# Altium project ECE315.PrjPcb
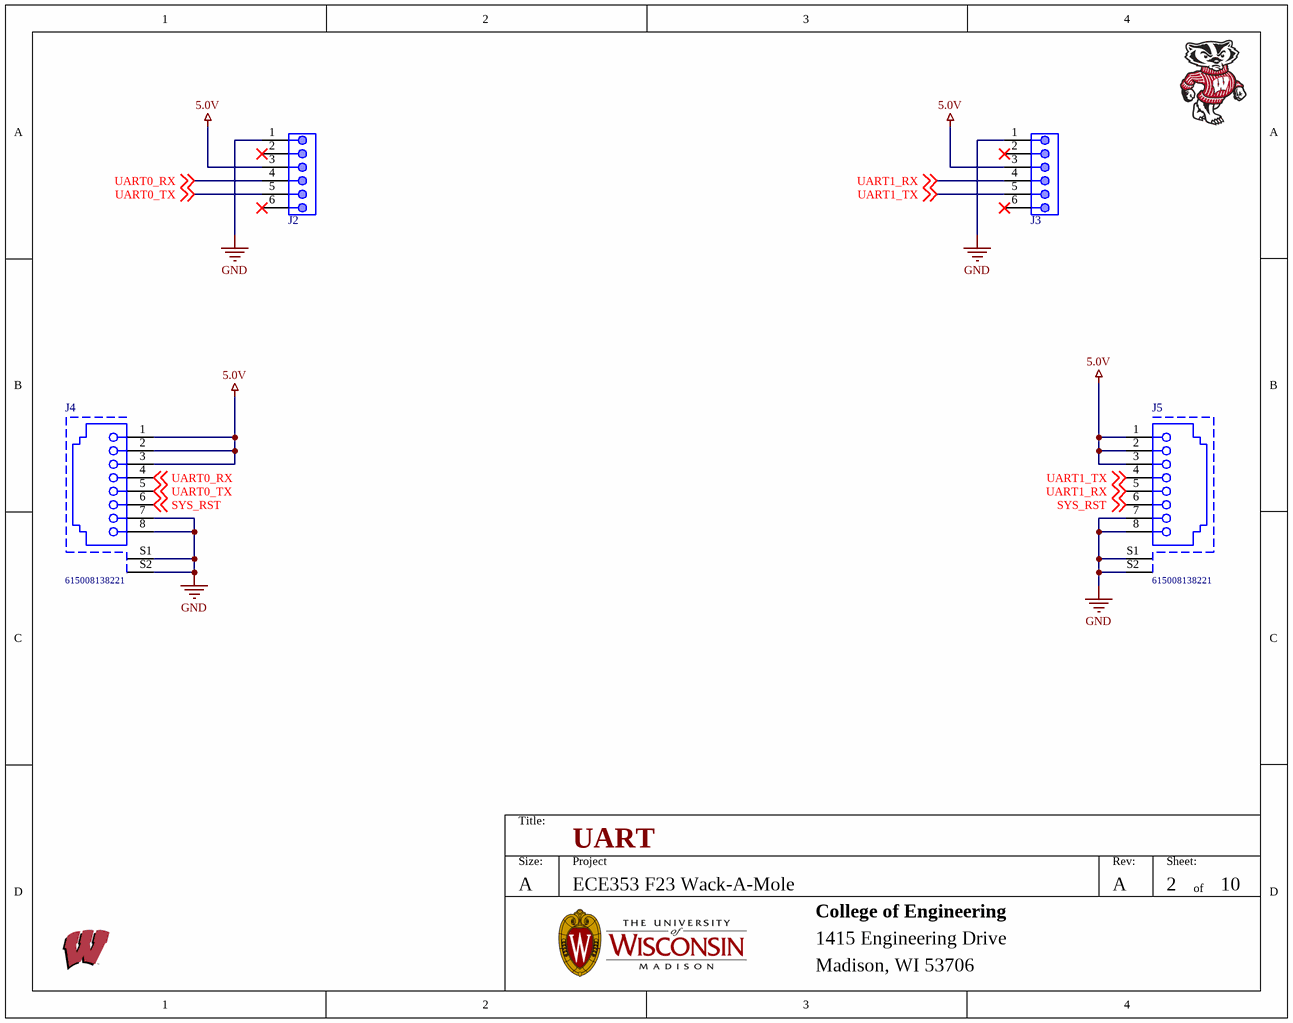
[diagram p0: 02-UART.SchDoc]
8 sheets, 62 parts. Net scope: global (net labels, ports and power ports of the same name join across sheets).
Board file: ECE315.PcbDoc
Sheets:
  02-UART.SchDoc
  03-LED-GREEN.SchDoc
  04-LED-YELLOW.SchDoc
  05-LED-RED.SchDoc
  06_MCU.SchDoc
  08-Power.SchDoc
  09_Buzzer.SchDoc
  10-Programmer.SchDoc

## Sheet 02-UART.SchDoc: UART
size A; Revision: A; SheetNumber: 2; SheetTotal: 10; ApprovedDate: 04/02/2019; AssemblyNumber: ECE315-F19; ECE315_Project_Name: ECE353 F23 Wack-A-Mole

### Parts
J2  (no value)  [HDR1X6]
J3  (no value)  [HDR1X6]
J4  615008138221  [615008138221]
J5  615008138221  [615008138221]

### Nets
5.0V: J2.3 J3.3 J4.1 J4.2 J4.3 J5.1 J5.2 J5.3
GND: J2.1 J3.1 J4.7 J4.8 J4.S1 J4.S2 J5.7 J5.8 J5.S1 J5.S2
SYS_RST: J4.6 J5.6 ; off-sheet SYS_RST
UART0_RX: J2.4 J4.4 ; off-sheet UART0_RX
UART0_TX: J2.5 J4.5 ; off-sheet UART0_TX
UART1_RX: J3.4 J5.5 ; off-sheet UART1_RX
UART1_TX: J3.5 J5.4 ; off-sheet UART1_TX

Not connected (* = marked no-connect by the designer): J2 2* 6*; J3 2* 6*

### Notes on the sheet
- Title:
- Size:
- A
- Project
- Rev:
- Sheet:
- of
- College of Engineering
- 1415 Engineering Drive
- Madison, WI 53706

### Library data of the parts
J2 J3 = CONN_HEADER_MALE_1x6: Female, 6C, Rt Angle, .100"CC; 3.15mm Tail, No Mounting; PBT, Phos. Bronze, 105 C; Manufacturer 1: Sullins; Manufacturer Part Number 1: PPPC061LGBN-RC; Number of Positions: 6; Connector Type: Header; Pitch: 0.1inch; Voltage Rating: 250V; Supplier 1: Digi-Key; Supplier Part Number 1: S5481-ND; RoHS: Yes; Category: Connectors; Stock 1: 12284; Pricing 1: 1=0.66, 10=0.56, 80=0.50288, 440=0.41148, 1000=0.36576, 5000=0.3302 (USD); Mount: Through Hole; Color: Black; Contact Plating: Gold; Contact Material: Bronze; Housing Color: Black; Housing Material: Plastic; Package Quantity: 1000; Number of Rows: 1; Packaging: Bulk; Termination: Solder; Contact Type: Female Socket; Length: 15.7mm; Width: 8.5mm; Height: 2.4mm; Lead Free: Lead Free; RoHS Compliant: Yes; ComponentLink1URL: https://media.digikey.com/pdf/Data%20Sheets/Sullins%20PDFs/Female_Headers.100_DS.pdf?src-supplier=Digi-Key; ComponentLink1Description: https://media.digikey.com/pdf/Data%20Sheets/Sullins%20PDFs/Female_Headers.100_DS.pdf?src-supplier=Digi-Key; ComponentLink2URL: http://www.sullinscorp.com/catalogs/78_Page80-81_HEADER_.100_2.54mm_FEMALE.pdf?src-supplier=Future+Electronics; ComponentLink2Description: http://www.sullinscorp.com/catalogs/78_Page80-81_HEADER_.100_2.54mm_FEMALE.pdf?src-supplier=Future+Electronics; Contact Finish - Mating: GOLD; Insulation Color: Black; Insulation Material: Polyester; Contact Shape: Square; Min Operating Temperature: -40°C; Max Operating Temperature: 105°C; Fastening Type: Pull; Series: -; Flammability Rating: UL94 V-0
J4 J5 = CMP-1502-01731-1: Modular Jack WR-MJ, Front Post, Shielded, Vertical Entry, THT, 8P8C; Manufacturer: Wurth Elektronik; Rated Current: 1.5A; Withstanding Voltage: 1000VAC; Working Voltage: 120VAC; Port: 1x1; Compliance: Leadfree/RoHS; Contact Resistance: 20mOhm; Publisher: WurthElektronik; Packaging: Tray; Manufacturer URL: http://www.we-online.de; Operating Temperature: -40to85degC; Package Reference: 615008138221; Mounting Technology: THT; Part Number: 615008138221; Datasheet URL: https://katalog.we-online.com/em/datasheet/615008138221.pdf; Pin Number: 8P8C; Entrance: Vertical

## Sheet 03-LED-GREEN.SchDoc: Green LEDs
size A; Revision: A; SheetNumber: 3; SheetTotal: 10; ECE315_Project_Name: ECE315 F23 Wack-A-Mole
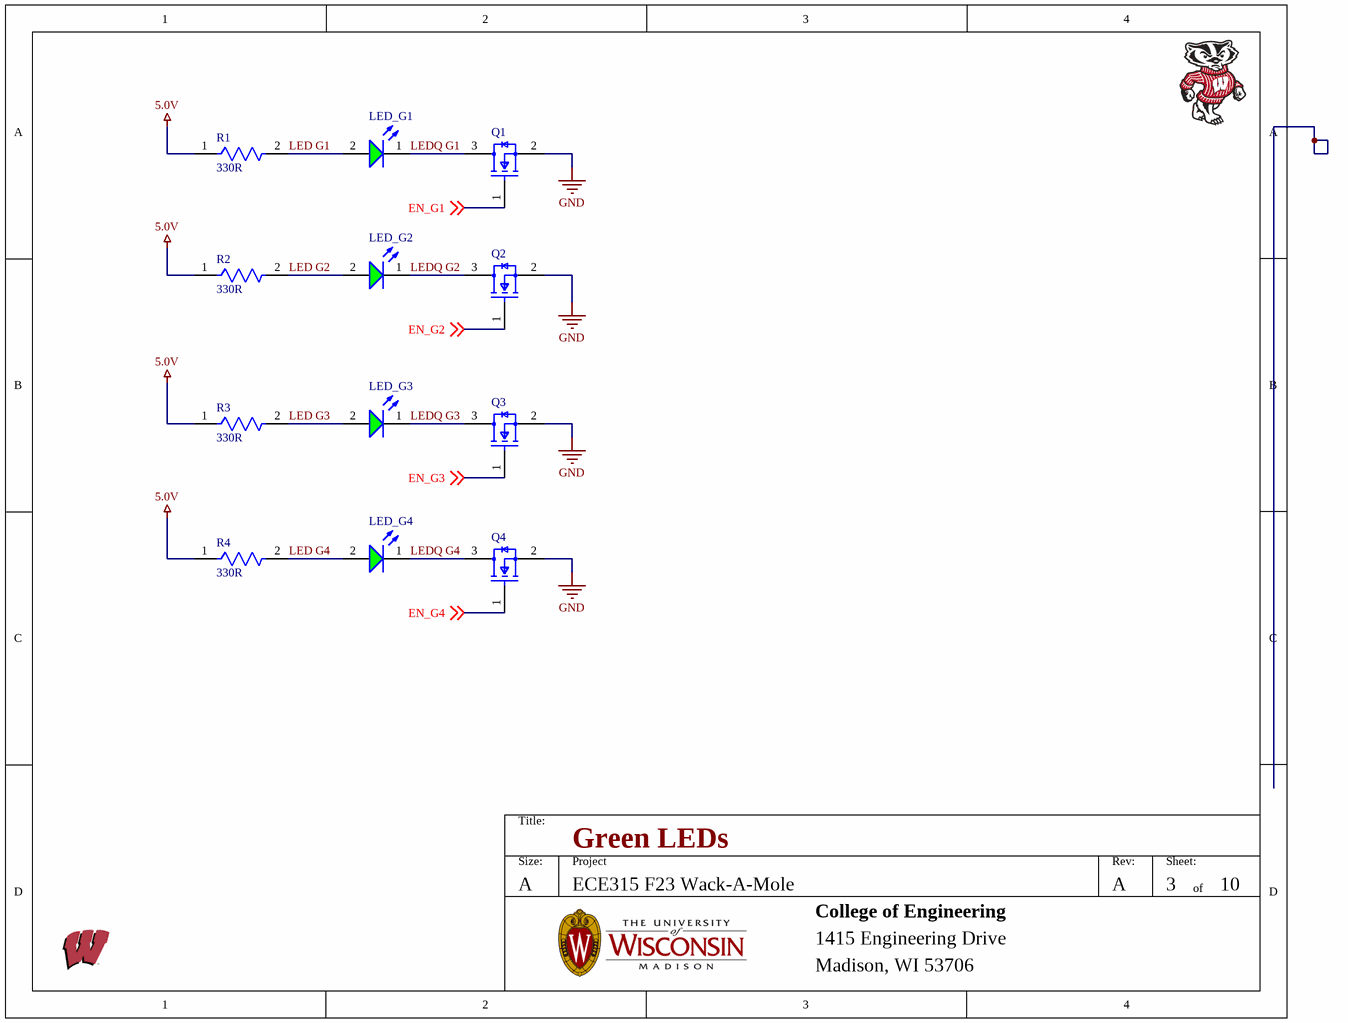
[diagram p1: 03-LED-GREEN.SchDoc]

### Parts
LED_G1  150120GS75000  [WL-SMCW_1206_150120xx75000]  (value not drawn)
LED_G2  150120GS75000  [WL-SMCW_1206_150120xx75000]  (value not drawn)
LED_G3  150120GS75000  [WL-SMCW_1206_150120xx75000]  (value not drawn)
LED_G4  150120GS75000  [WL-SMCW_1206_150120xx75000]  (value not drawn)
Q1  2N7002-7-F  [FP-SOT23-MFG]  (value not drawn)
Q2  2N7002-7-F  [FP-SOT23-MFG]  (value not drawn)
Q3  2N7002-7-F  [FP-SOT23-MFG]  (value not drawn)
Q4  2N7002-7-F  [FP-SOT23-MFG]  (value not drawn)
R1  Resistance: 330R  [FP-CRCW1206-e3-IPC_A]  (hidden comment: CRCW1206330RFKEA)
R2  Resistance: 330R  [FP-CRCW1206-e3-IPC_A]  (hidden comment: CRCW1206330RFKEA)
R3  Resistance: 330R  [FP-CRCW1206-e3-IPC_A]  (hidden comment: CRCW1206330RFKEA)
R4  Resistance: 330R  [FP-CRCW1206-e3-IPC_A]  (hidden comment: CRCW1206330RFKEA)

### Nets
5.0V: R1.1 R2.1 R3.1 R4.1
GND: Q1.2(S) Q2.2(S) Q3.2(S) Q4.2(S)
EN_G1: Q1.1(G) ; off-sheet EN_G1
EN_G2: Q2.1(G) ; off-sheet EN_G2
EN_G3: Q3.1(G) ; off-sheet EN_G3
EN_G4: Q4.1(G) ; off-sheet EN_G4
LED G1: LED_G1.2(A) R1.2
LED G2: LED_G2.2(A) R2.2
LED G3: LED_G3.2(A) R3.2
LED G4: LED_G4.2(A) R4.2
LEDQ G1: LED_G1.1(K) Q1.3(D)
LEDQ G2: LED_G2.1(K) Q2.3(D)
LEDQ G3: LED_G3.1(K) Q3.3(D)
LEDQ G4: LED_G4.1(K) Q4.3(D)

### Notes on the sheet
- Title:
- Size:
- A
- Project
- Rev:
- Sheet:
- of
- College of Engineering
- 1415 Engineering Drive
- Madison, WI 53706

### Library data of the parts
LED_G1-LED_G4 = CMP-1426-00014-3: NexarPartId: 29717787; Manufacturer: Wurth Electronics; Peak Wavelength: 515nm; Wavelength: 520nm; Test Current: 20mA; Dominant Wavelength: 525nm; Luminous Intensity: 450mcd; Max Junction Temperature (Tj): 95°C; Power Dissipation: 105mW; Reverse Voltage: 5V; Forward Current: 100mA; Viewing Angle: 140°; Forward Voltage: 3.2V; Lens Style: Clear, Rectangular; Lens Color: Colorless; Lens Transparency: Clear; Lens Size: 1.6mm; Width: 1.6mm; Case Code (Metric): 3216; Mount: Surface Mount; Min Operating Temperature: -40°C; Packaging: Tape and Reel; Length: 3.2mm; REACH SVHC: Unknown; Max Reverse Voltage (DC): 5V; Case/Package: 1206; Height: 680µm; Case Code (Imperial): 1206; Color: Green; RoHS: Compliant; Max Operating Temperature: 85°C; Supplier: Digi-Key; Supplier Part Number: 732-4990-1-ND; Manufacturer Part Number: 150120GS75000; Category: LEDs; Stock: 46051; Pricing: 1=0.23, 50=0.211, 100=0.182, 500=0.158 (USD); Mounting Technology: Surface Mount; Package Quantity: 1; Series: WL-SMCW; RoHS Compliant: Yes; Reach SVHC Compliant: Unknown; ComponentLink1URL: https://datasheet.ciiva.com/22656/150120gs75000-22656979.pdf?src-supplier=Element14; ComponentLink1Description: https://datasheet.ciiva.com/22656/150120gs75000-22656979.pdf?src-supplier=Element14; ComponentLink2URL: https://datasheet.ciiva.com/29279/759441-da-01-en-chipled-1206-w-kl-gruen-150120gs75000-29279042.pdf?src-supplier=Conrad; ComponentLink2Description: https://datasheet.ciiva.com/29279/759441-da-01-en-chipled-1206-w-kl-gruen-150120gs75000-29279042.pdf?src-supplier=Conrad; ComponentLink3URL: https://datasheet.ciiva.com/29561/150120gs75000-29561883.pdf?src-supplier=Digi-Key; ComponentLink3Description: https://datasheet.ciiva.com/29561/150120gs75000-29561883.pdf?src-supplier=Digi-Key; ComponentLink4URL: https://datasheet.ciiva.com/29561/150120gs75000-29561884.pdf?src-supplier=Digi-Key; ComponentLink4Description: https://datasheet.ciiva.com/29561/150120gs75000-29561884.pdf?src-supplier=Digi-Key; ComponentLink5URL: https://datasheet.ciiva.com/29561/150120gs75000-29561885.pdf?src-supplier=Digi-Key; ComponentLink5Description: https://datasheet.ciiva.com/29561/150120gs75000-29561885.pdf?src-supplier=Digi-Key; ComponentLink6URL: https://datasheet.ciiva.com/48430/150120gs75000-eng-tds-48430053.pdf?src-supplier=Distrelec; ComponentLink6Description: https://datasheet.ciiva.com/48430/150120gs75000-eng-tds-48430053.pdf?src-supplier=Distrelec
Q1-Q4 = CMP-2000-04929-2: MOSFET N-CH 60V 115MA SOT23-3; Turn-On Delay Time: 7ns; Turn-Off Delay Time: 11ns; Drain to Source Resistance: 7.5R; Rise Time: 3ns; Drain to Source Breakdown Voltage: 70V; Input Capacitance: 50pF; Number of Elements: 1; Power Dissipation: 540mW; Max Power Dissipation: 300mW; Fall Time: 5.6ns; Gate to Source Voltage (Vgs): 20V; Threshold Voltage: 2.5V; Element Configuration: Single; Termination: SMD/SMT; Weight: 0.000282oz; Radiation Hardening: No; Max Operating Temperature: 150°C; On-State Resistance: 7.5R; Mount: Surface Mount; Current Rating: 115mA; Contact Plating: Tin; Lead Free: Lead Free; Min Operating Temperature: -55°C; Number of Pins: 3; REACH SVHC: No SVHC; Drain to Source Voltage (Vdss): 60V; Width: 1.3mm; Package Quantity: 3000; Length: 2.9mm; Case/Package: SOT-23; Number of Channels: 1; Dual Supply Voltage: 60V; Packaging: Tape and Reel; Height: 1mm; Voltage Rating (DC): 60V; Nominal Vgs: 2.5V; Continuous Drain Current (ID): 115mA; Voltage: 60V; Rds On Max: 7.5R
R1-R4 = CMP-2003-02098-2: RES Thick Film, 330Ω, 1%, 0.25W, 100ppm/°C, 1206; Voltage Rating: 200V; Max Power Dissipation: 250mW; Height: 0.55mm; Mount: Surface Mount; Min Operating Temperature: -55°C; Depth: 1.6mm; Features: Automotive AEC-Q200; Voltage Rating (DC): 200V; Military Standard: Not; Packaging: Tape and Reel; Composition: Thick Film; Contact Plating: Tin; Case Code (Imperial): 1206; Case/Package: 1206; Number of Terminations: 2; Length: 3.2mm; Lead Free: Lead Free; Tolerance: 1%; Temperature Coefficient: 100ppm/°C; Case Code (Metric): 3216; Width: 1.6mm; Weight: 0.000353oz; Termination: SMD/SMT; Radiation Hardening: No; Package Quantity: 10; Power Rating: 250mW; Max Operating Temperature: 155°C

## Sheet 04-LED-YELLOW.SchDoc: Yellow LEDs
size A; Revision: A; SheetNumber: 4; SheetTotal: 10; ECE315_Project_Name: ECE315 F23 Wack-A-Mole; ImagePath: 4
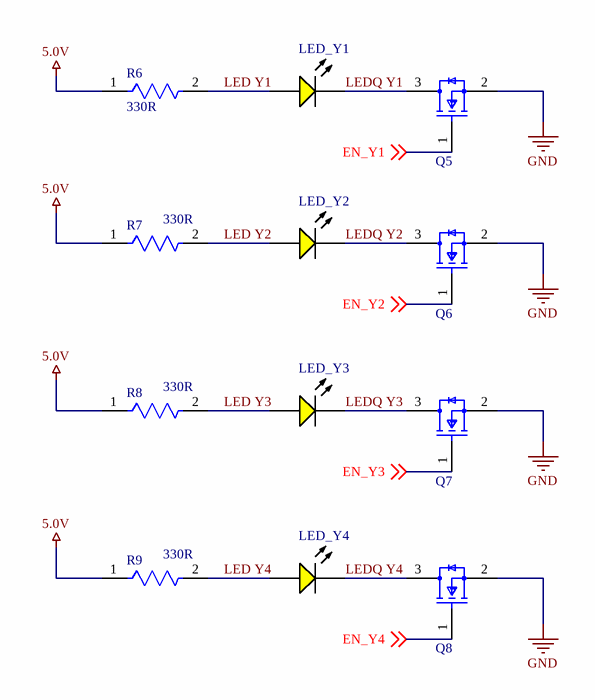
[diagram p2: 04-LED-YELLOW.SchDoc]

### Parts
LED_Y1  SML-LX1206YC-TR  [LUMX-SML-LX1206YC-TR_V]  (value not drawn)
LED_Y2  SML-LX1206YC-TR  [LUMX-SML-LX1206YC-TR_V]  (value not drawn)
LED_Y3  SML-LX1206YC-TR  [LUMX-SML-LX1206YC-TR_V]  (value not drawn)
LED_Y4  SML-LX1206YC-TR  [LUMX-SML-LX1206YC-TR_V]  (value not drawn)
Q5  2N7002-7-F  [FP-SOT23-MFG]  (value not drawn)
Q6  2N7002-7-F  [FP-SOT23-MFG]  (value not drawn)
Q7  2N7002-7-F  [FP-SOT23-MFG]  (value not drawn)
Q8  2N7002-7-F  [FP-SOT23-MFG]  (value not drawn)
R6  Resistance: 330R  [FP-CRCW1206-e3-IPC_A]  (hidden comment: CRCW1206330RFKEA)
R7  Resistance: 330R  [FP-CRCW1206-e3-IPC_A]  (hidden comment: CRCW1206330RFKEA)
R8  Resistance: 330R  [FP-CRCW1206-e3-IPC_A]  (hidden comment: CRCW1206330RFKEA)
R9  Resistance: 330R  [FP-CRCW1206-e3-IPC_A]  (hidden comment: CRCW1206330RFKEA)

### Nets
5.0V: R6.1 R7.1 R8.1 R9.1
GND: Q5.2(S) Q6.2(S) Q7.2(S) Q8.2(S)
EN_Y1: Q5.1(G) ; off-sheet EN_Y1
EN_Y2: Q6.1(G) ; off-sheet EN_Y2
EN_Y3: Q7.1(G) ; off-sheet EN_Y3
EN_Y4: Q8.1(G) ; off-sheet EN_Y4
LED Y1: LED_Y1.1(A) R6.2
LED Y2: LED_Y2.1(A) R7.2
LED Y3: LED_Y3.1(A) R8.2
LED Y4: LED_Y4.1(A) R9.2
LEDQ Y1: LED_Y1.2(K) Q5.3(D)
LEDQ Y2: LED_Y2.2(K) Q6.3(D)
LEDQ Y3: LED_Y3.2(K) Q7.3(D)
LEDQ Y4: LED_Y4.2(K) Q8.3(D)

### Notes on the sheet
- Title:
- Size:
- A
- Project
- Rev:
- Sheet:
- of
- College of Engineering
- 1415 Engineering Drive
- Madison, WI 53706

### Library data of the parts
LED_Y1-LED_Y4 = CMP-2000-07124-1: Yellow LED, Water Clear Len, 585 nm, 2.1 V, -40 to 85 degC, 2-Pin SMD, RoHS, Tape and Reel; Manufacturer: Lumex; Product Training Modules: LEDsBenefitsofCustomLEDandLCDTechnology; Millicandela Rating: 6mcd; Catalog Drawings: SML-LX1206SeriesTopSML-LX1206SeriesSideSML-LX1206SeriesBottomSML-LX1206SeriesFootprint; Wavelength - Peak: 585nm; Other Names: 67-1358-2LU60357TRSMLLX1206YCTR; Lens Style/Size: RectanglewithFlatTop; Current - Test: 20mA; Lens Color: Colorless; Viewing Angle: 160°; Voltage - Forward (Vf) (Typ): 2.1V; Online Catalog: SML-LX1206RectanglewithFlatTop1206PackageLEDs; Lens Style: Flat,Rectangular,Diffused,Colorless; Dominant Wavelength: 568nm; Number of LEDs: 1; Power Rating: 65mW; Lens Size: 1.5mm; Approvals: UL,CSA; Mounting Type: SurfaceMount; Package Description: 2-Pin Surface Mount Device, Body 3.2 x 1.5 mm; Datasheet Version: Rev. K, 08/2012; Features: -; Color: Yellow; RoHS Information: RoHSCertofCompliance; Package Reference: SML-LX1206YC-TR; Supplier Device Package: 1206; Standard Package: 3,000; Series: -; Wavelength - Dominant: -; Package / Case: 1206(3216Metric); Mounting Technology: SurfaceMount; Height (Max): 1.10mm; Lens Transparency: Clear; Datasheet URL: http://www.lumex.com/content/files/ProductAttachment/SML-LX1206YC-TR.pdf; Family: LEDIndication-Discrete; Manufacturer URL: http://www.lumexinstruments.com/; Packaging: Tape&Reel(TR); Category: Optoelectronics; Size / Dimension: 3.20mmLx1.60mmW; Supplier 1: Digi-Key; Supplier Part Number 1: 67-1358-1-ND; Manufacturer 1: Lumex; Manufacturer Part Number 1: SML-LX1206YC-TR; RoHS: Yes; Stock 1: 74573; Pricing 1: 1=0.41000, 10=0.26800, 100=0.17870, 500=0.12360, 1000=0.10300 (USD); Mount: Surface Mount; Case/Package: 1206; Number of Pins: 2; Case Code (Metric): 3216; Case Code (Imperial): 1206; Min Operating Temperature: -25°C; Max Operating Temperature: 85°C; Forward Voltage: 2.1V; Luminous Intensity: 6mcd; Forward Current: 20mA; Wavelength: 585nm; Package Quantity: 3000; Test Current: 20mA; Illumination Color: Yellow; Moisture Sensitivity Level: 2; Length: 3.2mm; Width: 1.6mm; Height: 1.1mm; RoHS Compliant: Yes; Lead Free: Lead Free; Reach SVHC Compliant: Yes; ComponentLink1URL: https://datasheet.ciiva.com/8072/269322-8072890.pdf?src-supplier=Element14; ComponentLink1Description: https://datasheet.ciiva.com/8072/269322-8072890.pdf?src-supplier=Element14; ComponentLink2URL: https://datasheet.ciiva.com/4689/sml-lx1206yc-tr-112772-4689232.pdf?src-supplier=Mouser; ComponentLink2Description: https://datasheet.ciiva.com/4689/sml-lx1206yc-tr-112772-4689232.pdf?src-supplier=Mouser; ComponentLink3URL: https://datasheet.ciiva.com/2110/sml-lx1206yc-tr-2110320.pdf?src-supplier=Digi-Key; ComponentLink3Description: https://datasheet.ciiva.com/2110/sml-lx1206yc-tr-2110320.pdf?src-supplier=Digi-Key; ComponentLink4URL: https://datasheet.ciiva.com/8073/269322-8073067.pdf?src-supplier=Element14; ComponentLink4Description: https://datasheet.ciiva.com/8073/269322-8073067.pdf?src-supplier=Element14; Supplier 2: Newark; Supplier Part Number 2: 09J9559
Q5-Q8 = CMP-2000-04929-2: as Q1 on sheet 03-LED-GREEN; Termination: SMD/SMT; Weight: 0.000282oz; Radiation Hardening: No; Max Operating Temperature: 150°C; On-State Resistance: 7.5R; Mount: Surface Mount; Current Rating: 115mA; Contact Plating: Tin; Lead Free: Lead Free; Min Operating Temperature: -55°C; Number of Pins: 3; REACH SVHC: No SVHC; Drain to Source Voltage (Vdss): 60V; Width: 1.3mm; Package Quantity: 3000; Length: 2.9mm; Case/Package: SOT-23; Number of Channels: 1; Dual Supply Voltage: 60V; Packaging: Tape and Reel; Height: 1mm; Voltage Rating (DC): 60V; Nominal Vgs: 2.5V; Continuous Drain Current (ID): 115mA; Voltage: 60V; Rds On Max: 7.5R
R6-R9 = CMP-2003-02098-2: as R1 on sheet 03-LED-GREEN; Height: 0.55mm; Mount: Surface Mount; Min Operating Temperature: -55°C; Depth: 1.6mm; Features: Automotive AEC-Q200; Voltage Rating (DC): 200V; Military Standard: Not; Packaging: Tape and Reel; Composition: Thick Film; Contact Plating: Tin; Case Code (Imperial): 1206; Case/Package: 1206; Number of Terminations: 2; Length: 3.2mm; Lead Free: Lead Free; Tolerance: 1%; Temperature Coefficient: 100ppm/°C; Case Code (Metric): 3216; Width: 1.6mm; Weight: 0.000353oz; Termination: SMD/SMT; Radiation Hardening: No; Package Quantity: 10; Power Rating: 250mW; Max Operating Temperature: 155°C

## Sheet 05-LED-RED.SchDoc: Red LEDs
size A; Revision: A; SheetNumber: 5; SheetTotal: 10; ECE315_Project_Name: ECE315 F23 Wack-A-Mole
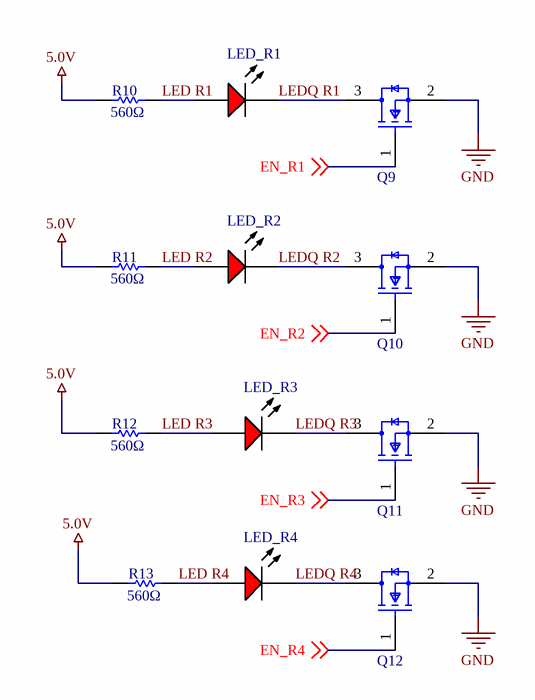
[diagram p3: 05-LED-RED.SchDoc]

### Parts
LED_R1  SML-LX1206IC-TR  [LUMX-SML-LX1206IC_V]  (value not drawn)
LED_R2  SML-LX1206IC-TR  [LUMX-SML-LX1206IC_V]  (value not drawn)
LED_R3  SML-LX1206IC-TR  [LUMX-SML-LX1206IC_V]  (value not drawn)
LED_R4  SML-LX1206IC-TR  [LUMX-SML-LX1206IC_V]  (value not drawn)
Q9  2N7002-7-F  [FP-SOT23-MFG]  (value not drawn)
Q10  2N7002-7-F  [FP-SOT23-MFG]  (value not drawn)
Q11  2N7002-7-F  [FP-SOT23-MFG]  (value not drawn)
Q12  2N7002-7-F  [FP-SOT23-MFG]  (value not drawn)
R10  560Ω  [RESC3216X70X50LL05T20]
R11  560Ω  [RESC3216X70X50LL05T20]
R12  560Ω  [RESC3216X70X50LL05T20]
R13  560Ω  [RESC3216X70X50LL05T20]

### Nets
5.0V: R10.1 R11.1 R12.1 R13.1
GND: Q9.2(S) Q10.2(S) Q11.2(S) Q12.2(S)
EN_R1: Q9.1(G) ; off-sheet EN_R1
EN_R2: Q10.1(G) ; off-sheet EN_R2
EN_R3: Q11.1(G) ; off-sheet EN_R3
EN_R4: Q12.1(G) ; off-sheet EN_R4
LED R1: LED_R1.1(A) R10.2
LED R2: LED_R2.1(A) R11.2
LED R3: LED_R3.1(A) R12.2
LED R4: LED_R4.1(A) R13.2
LEDQ R1: LED_R1.2(K) Q9.3(D)
LEDQ R2: LED_R2.2(K) Q10.3(D)
LEDQ R3: LED_R3.2(K) Q11.3(D)
LEDQ R4: LED_R4.2(K) Q12.3(D)

### Notes on the sheet
- Title:
- Size:
- A
- Project
- Rev:
- Sheet:
- of
- College of Engineering
- 1415 Engineering Drive
- Madison, WI 53706

### Library data of the parts
LED_R1-LED_R4 = CMP-2000-07123-1: LED Red, 65 mW, -40 to 85 degC, 2-Pin SMD, RoHS, Tape and Reel; Manufacturer: Lumex; Manufacturer Part Number 1: SMLLX1206ICTR; LED Material: GaAsP; Peak Wavelength: 635nm; Number of LEDs: 1; Viewing Angle: 160; Reverse Voltage: 5(Min)V; Lens Appearance: ColorlessNonDiffused; Intensity: 6mcd; Pin_Count: 2; Lens Color: Colorless,Clear; Forward Voltage: 2.6V; Test Current: 20mA; Lens Style: Clear,Diffused,Colorless,Rectangular; Forward Current: 100mA; Lens Transparency: Clear; Power Rating: 65mW; Voltage Rating (DC): 2V; Current Rating: 25mA; Lens Size: 1.5mm; Approvals: UL,CSA; Lens Dimensions: 2x1.6x0.5mm; Mounting: SurfaceMount; ECCN: EAR99; RoHS: Unknown; Package Description: 2-Pin Surface Mount Device, Body 3.2 x 1.5 mm; Mounting Technology: SurfaceMount; Dominant Wavelength: N/A; Supplier_Package: SMD; Supplier Standard Pack: 3,000; Color: Red; Dimension: 3.2x1.6x1.1mm; HTS: 8541402000; Part No: SML-LX1206IC-TR; Family: SML-LX1206IC; Supplier: Lumex; Datasheet URL: http://www.lumex.com/content/files/ProductAttachment/SML-LX1206IC-TR.pdf; Package Reference: SML-LX1206IC; Manufacturer URL: http://www.lumexinstruments.com/; Type: Uni-Color; Operating Temperature: -25to85C; Packaging: TapeandReel; Datasheet Version: Rev. J, 08/2012; Supplier 1: Digi-Key; Supplier Part Number 1: 67-1356-1-ND; Manufacturer 1: Lumex; Category: LEDs; Stock 1: 113609; Pricing 1: 1=0.39000, 10=0.30600, 100=0.13730, 500=0.12402, 1000=0.10187 (USD); Mount: Surface Mount; Case/Package: 1206; Number of Pins: 2; Case Code (Metric): 3216; Case Code (Imperial): 1206; Min Operating Temperature: -40°C; Max Operating Temperature: 85°C; Luminous Intensity: 6mcd; Package Quantity: 3000; Wavelength: 635nm; Illumination Color: Red; Series: -; Moisture Sensitivity Level: 2; Voltage Rating: 2V; Length: 3.2mm; Width: 1.6mm; Height: 1.1mm; Lead Free: Lead Free; Reach SVHC Compliant: Yes; ComponentLink1URL: https://datasheet.ciiva.com/12400/sml-lx1206ic-tr-112319-12400827.pdf?src-supplier=Mouser; ComponentLink1Description: https://datasheet.ciiva.com/12400/sml-lx1206ic-tr-112319-12400827.pdf?src-supplier=Mouser; ComponentLink2URL: https://datasheet.ciiva.com/16199/sml-lx1206ic-tr-16199616.pdf?src-supplier=Future+Electronics; ComponentLink2Description: https://datasheet.ciiva.com/16199/sml-lx1206ic-tr-16199616.pdf?src-supplier=Future+Electronics; ComponentLink3URL: https://datasheet.ciiva.com/2110/sml-lx1206ic-tr-2110300.pdf?src-supplier=Digi-Key; ComponentLink3Description: https://datasheet.ciiva.com/2110/sml-lx1206ic-tr-2110300.pdf?src-supplier=Digi-Key; ComponentLink4URL: https://datasheet.ciiva.com/2110/sml-lx1206ic-tr-2110301.pdf?src-supplier=Digi-Key; ComponentLink4Description: https://datasheet.ciiva.com/2110/sml-lx1206ic-tr-2110301.pdf?src-supplier=Digi-Key; ComponentLink5URL: https://datasheet.ciiva.com/2110/sml-lx1206ic-tr-2110302.pdf?src-supplier=Digi-Key; ComponentLink5Description: https://datasheet.ciiva.com/2110/sml-lx1206ic-tr-2110302.pdf?src-supplier=Digi-Key; ComponentLink6URL: https://datasheet.ciiva.com/30187/sml-lx1206ic-tr-30187578.pdf?src-supplier=Onlinecomponents.com; ComponentLink6Description: https://datasheet.ciiva.com/30187/sml-lx1206ic-tr-30187578.pdf?src-supplier=Onlinecomponents.com; ComponentLink7URL: https://datasheet.ciiva.com/8072/195796-8072871.pdf?src-supplier=Element14; ComponentLink7Description: https://datasheet.ciiva.com/8072/195796-8072871.pdf?src-supplier=Element14; ComponentLink8URL: https://datasheet.ciiva.com/8073/195796-8073097.pdf?src-supplier=Element14; ComponentLink8Description: https://datasheet.ciiva.com/8073/195796-8073097.pdf?src-supplier=Element14; ComponentLink9URL: https://datasheet.ciiva.com/15967/sml-lx1206ic-tr-15967210.pdf?src-supplier=Onlinecomponents.com; ComponentLink9Description: https://datasheet.ciiva.com/15967/sml-lx1206ic-tr-15967210.pdf?src-supplier=Onlinecomponents.com; Supplier 2: Newark; Supplier Part Number 2: 80K7325
Q9-Q12 = CMP-2000-04929-2: as Q1 on sheet 03-LED-GREEN; Termination: SMD/SMT; Weight: 0.000282oz; Radiation Hardening: No; Max Operating Temperature: 150°C; On-State Resistance: 7.5R; Mount: Surface Mount; Current Rating: 115mA; Contact Plating: Tin; Lead Free: Lead Free; Min Operating Temperature: -55°C; Number of Pins: 3; REACH SVHC: No SVHC; Drain to Source Voltage (Vdss): 60V; Width: 1.3mm; Package Quantity: 3000; Length: 2.9mm; Case/Package: SOT-23; Number of Channels: 1; Dual Supply Voltage: 60V; Packaging: Tape and Reel; Height: 1mm; Voltage Rating (DC): 60V; Nominal Vgs: 2.5V; Continuous Drain Current (ID): 115mA; Voltage: 60V; Rds On Max: 7.5R
R10-R13 = CMP-2003-00856-1: Part Number: ERJ8ENF5600V; Manufacturer: Panasonic

## Sheet 06_MCU.SchDoc: PSoC4
size A; Revision: A; SheetNumber: 6; SheetTotal: 10; ECE315_Project_Name: ECE315 F23 Wack-A-Mole
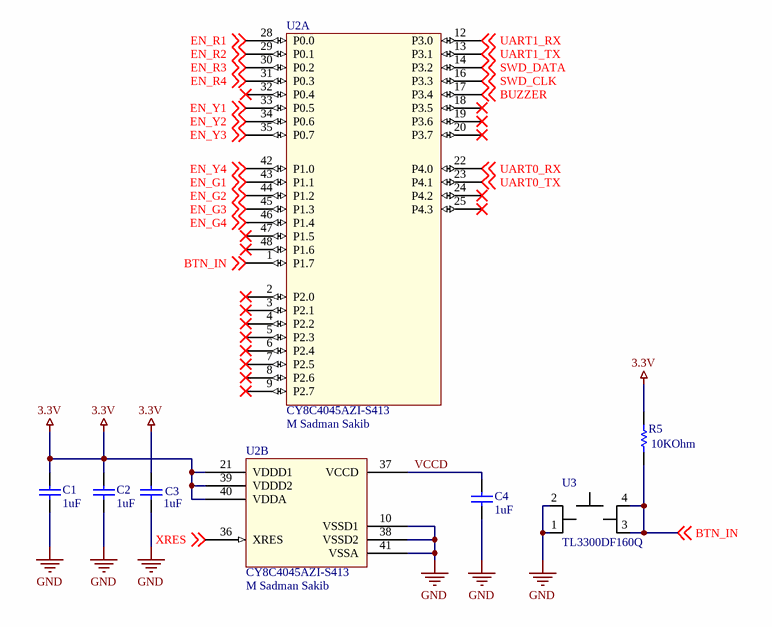
[diagram p4: 06_MCU.SchDoc]

### Parts
C1  Capacitance: 1uF  [CAPC3216X180X50ML20T25]  (hidden comment: C1206C105K3RACTU)
C2  Capacitance: 1uF  [CAPC3216X180X50ML20T25]  (hidden comment: C1206C105K3RACTU)
C3  Capacitance: 1uF  [CAPC3216X180X50ML20T25]  (hidden comment: C1206C105K3RACTU)
C4  Capacitance: 1uF  [CAPC3216X180X50ML20T25]  (hidden comment: C1206C105K3RACTU)
R5  Resistance: 10KOhm  [RESC3116X65X40ML10T20]  (hidden comment: RC1206FR-0710KL)
U2  CY8C4045AZI-S413  [TQFP48_7X7]  (parts A,B of 2)
U3  TL3300DF160Q  [TL3300DF160Q]

### Nets
3.3V: C1.2 C2.2 C3.2 R5.2 U2.21(VDDD1) U2.39(VDDD2) U2.40(VDDA)
GND: C1.1 C2.1 C3.1 C4.1 U2.10(VSSD1) U2.38(VSSD2) U2.41(VSSA) U3.1 U3.2
BTN_IN: R5.1 U2.1(P1.7) U3.3 U3.4(VCCIO) ; off-sheet BTN_IN
BUZZER: U2.17(P3.4) ; off-sheet BUZZER
EN_G1: U2.43(P1.1) ; off-sheet EN_G1
EN_G2: U2.44(P1.2) ; off-sheet EN_G2
EN_G3: U2.45(P1.3) ; off-sheet EN_G3
EN_G4: U2.46(P1.4) ; off-sheet EN_G4
EN_R1: U2.28(P0.0) ; off-sheet EN_R1
EN_R2: U2.29(P0.1) ; off-sheet EN_R2
EN_R3: U2.30(P0.2) ; off-sheet EN_R3
EN_R4: U2.31(P0.3) ; off-sheet EN_R4
EN_Y1: U2.33(P0.5) ; off-sheet EN_Y1
EN_Y2: U2.34(P0.6) ; off-sheet EN_Y2
EN_Y3: U2.35(P0.7) ; off-sheet EN_Y3
EN_Y4: U2.42(P1.0) ; off-sheet EN_Y4
SWD_CLK: U2.16(P3.3) ; off-sheet SWD_CLK
SWD_DATA: U2.14(P3.2) ; off-sheet SWD_DATA
UART0_RX: U2.22(P4.0) ; off-sheet UART0_RX
UART0_TX: U2.23(P4.1) ; off-sheet UART0_TX
UART1_RX: U2.12(P3.0) ; off-sheet UART1_RX
UART1_TX: U2.13(P3.1) ; off-sheet UART1_TX
VCCD: C4.2 U2.37(VCCD)
XRES: U2.36(XRES) ; off-sheet XRES

Not connected (* = marked no-connect by the designer): U2 2(P2.0)* 3(P2.1)* 4(P2.2)* 5(P2.3)* 6(P2.4)* 7(P2.5)* 8(P2.6)* 9(P2.7)* 18(P3.5)* 19(P3.6)* 20(P3.7)* 24(P4.2)* 25(P4.3)* 32(P0.4)* 47(P1.5)* 48(P1.6)*

### Notes on the sheet
- Title:
- Size:
- A
- Project
- Rev:
- Sheet:
- of
- College of Engineering
- 1415 Engineering Drive
- Madison, WI 53706

### Library data of the parts
C1-C4 = CMP-2000-04991-1: Chip Capacitor, 1 uF, +/- 10%, 25 V, -55 to 125 degC, 1206 (3216 Metric), RoHS, Tape and Reel; Manufacturer: Kemet; Temperature Coefficient / Code: +/-15%; Dielectric: X7R; Voltage Rating DC: 25V; Capacitance - nF: 1000nF; Class: Class1; Case Length: 3.2mm; Type: SMDMLCCX7R6.3-250VDCCommericalGrade; Case Width: 1.6mm; Product: GeneralTypeMLCCs; Datasheet URL: https://ciiva.com/datasheet-click-18194173?src=ciiva&sig=6daff8c4; Operating Temperature Range: -55Cto+125C; Series: C1206C; RoHS: Details; Product Category: MultilayerCeramicCapacitorsMLCC-SMD/SMT; Manufacturer URL: http://www.kemet.com/; Minimum Operating Temperature: -55C; Dimensions: 1.6mmWx3.2mmLx1.6mmH; Termination Style: SMD/SMT; Brand: Kemet; Packaging: Reel; Package / Case: 1206(3216metric); Case Code - mm: 3216; Datasheet Version: Jul-14; Factory Pack Quantity: 2000; Package Description: 2-Pin Surface Mount Device, Body 3.2 x 1.6 mm; Tolerance: 10%; Package Reference: 1206; Case Height: 1.6mm; Case Code - in: 1206; Maximum Operating Temperature: +125C; Voltage Rating: 25V
R5 = CMP-1014-00623-2: Chip Resistor, 10 KOhm, +/- 1%, 0.25 W, -55 to 155 degC, 1206 (3216 Metric), RoHS, Tape and Reel; Manufacturer: Yageo; Voltage Rating: 200V; Temperature Coefficient: 100ppm/degreesC; Power Rating: 250mW; Packaging: TapeandReel; Termination: SMD/SMT; REACH SVHC: Unknown; Tolerance: 1%; Height: 0.55mm; Composition: ThickFilm; Max Operating Temperature: 155degC; Datasheet Version: Rev. 5, 10/2016; Lead Free: LeadFree; Case Code (Metric): 3216; Depth: 1.6mm; Package Quantity: 5000; RoHSCompliant: true; Military Standard: Not; Case/Package: 1206; Case Code (Imperial): 1206; Min Operating Temperature: -55degC; Datasheet URL: http://www.yageo.com/NewPortal/yageodocoutput?fileName=/pdf/R-Chip/PYu-RC_Group_51_RoHS_L_5.pdf; Length: 3.1mm; Manufacturer URL: http://www.yageo.com/; Package Reference: 1206.0; Width: 1.6mm; Package Description: 2-Pin Surface Mount Device, Body 3.1 x 1.6 mm
U2 = CY8C4045AZI-S413: ARM Microcontrollers - MCU PSoC4; Manufacturer 1: Infineon; Supplier 1: Digi-Key; Supplier Part Number 1: 448-CY8C4045AZI-S413-ND; Manufacturer Part Number 1: CY8C4045AZI-S413; RoHS: Yes; Category: Uncategorized; Stock 1: 12044; Pricing 1: 1=3.87, 10=3.474, 25=3.284, 80=2.846, 250=2.70008, 500=2.42276, 1000=2.0433, 2500=1.946 (USD); RoHS Compliant: Yes; Parameter 1: *; M Sadman Sakib: M Sadman Sakib
U3 = TL3300DF160Q: Switch Tactile OFF (ON) SPST Round Button Gull Wing 0.05A 12VDC 1.57N SMD; Manufacturer: E-Switch; Contact Rating @ Voltage: 0.05A @ 12VDC; Outline: 12.00mm x 12.00mm; Circuit: SPST-NO; Switch Travel: 0.35mm; Actuator Type: Standard; Mechanical Life: 200,000 Cycles; Switch Function: Off-Mom; Actuator Height off PCB, from Pins: 4.30mm; Illumination: Non-Illuminated; Operating Force: 160gf; Actuator Orientation: Top Actuated; Current Rating: 50mA; Voltage Rating (DC): 12V; Illumination Voltage (Nominal): -; Mounting Type: Surface Mount; Illumination Type, Color: -; Packaging: Cut Tape (CT); Ingress Protection: -; RoHS: RoHS Compliant; Actuator Material: -; Category: Switches; Manufacturer Part Number: TL3300DF160Q; Operating Temperature: -25°C ~ 70°C; Features: -; Termination Style: Gull Wing; Supplier: Digi-Key; Supplier Part Number: EG4906CT-ND; Supplier 1: Digi-Key; Supplier Part Number 1: EG4906CT-ND; Manufacturer 1: E-Switch; Manufacturer Part Number 1: TL3300DF160Q; Stock 1: 57403; Pricing 1: 1=0.60000, 10=0.57800, 25=0.55680, 100=0.48180, 250=0.43896 (USD); Mount: Surface Mount; Case/Package: SMD/SMT; Contact Plating: Silver; Min Operating Temperature: -25°C; Max Operating Temperature: 70°C; Package Quantity: 1; Termination: Gull Wing; Illumination Type: Non-Illuminated; Throw Configuration: SPST; Series: TL3300; RoHS Compliant: Yes; ComponentLink1URL: https://datasheet.ciiva.com/2900/n301101-2900856.pdf?src-supplier=Digi-Key; ComponentLink1Description: https://datasheet.ciiva.com/2900/n301101-2900856.pdf?src-supplier=Digi-Key; ComponentLink2URL: https://datasheet.ciiva.com/2900/n301101-2900858.pdf?src-supplier=Digi-Key; ComponentLink2Description: https://datasheet.ciiva.com/2900/n301101-2900858.pdf?src-supplier=Digi-Key

## Sheet 08-Power.SchDoc: Power
size A; Revision: A; SheetNumber: 8; SheetTotal: 10; ECE315_Project_Name: ECE315 F23 Wack-A-Mole
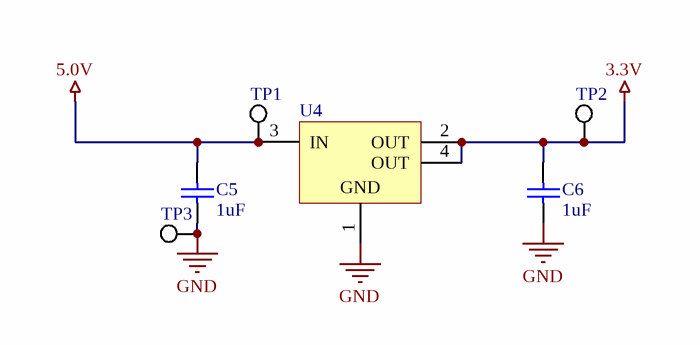
[diagram p5: 08-Power.SchDoc]

### Parts
C5  Capacitance: 1uF  [CAPC3216X180X50ML20T25]  (hidden comment: C1206C105K3RACTU)
C6  Capacitance: 1uF  [CAPC3216X180X50ML20T25]  (hidden comment: C1206C105K3RACTU)
TP1  5019  [KSTN-5019_V]  (value not drawn)
TP2  5019  [KSTN-5019_V]  (value not drawn)
TP3  5019  [KSTN-5019_V]  (value not drawn)
U4  TLV1117LV33DCYR  [DCY0004A_N]  (value not drawn)

### Nets
3.3V: C6.2 TP2.1 U4.2(OUT) U4.4(OUT)
5.0V: C5.2 TP1.1 U4.3(IN)
GND: C5.1 C6.1 TP3.1 U4.1(GND)

### Notes on the sheet
- Title:
- Size:
- A
- Project
- Rev:
- Sheet:
- of
- College of Engineering
- 1415 Engineering Drive
- Madison, WI 53706

### Library data of the parts
C5 C6 = CMP-2000-04991-1: as C1 on sheet 06_MCU; Product: GeneralTypeMLCCs; Datasheet URL: https://ciiva.com/datasheet-click-18194173?src=ciiva&sig=6daff8c4; Operating Temperature Range: -55Cto+125C; Series: C1206C; RoHS: Details; Product Category: MultilayerCeramicCapacitorsMLCC-SMD/SMT; Manufacturer URL: http://www.kemet.com/; Minimum Operating Temperature: -55C; Dimensions: 1.6mmWx3.2mmLx1.6mmH; Termination Style: SMD/SMT; Brand: Kemet; Packaging: Reel; Package / Case: 1206(3216metric); Case Code - mm: 3216; Datasheet Version: Jul-14; Factory Pack Quantity: 2000; Package Description: 2-Pin Surface Mount Device, Body 3.2 x 1.6 mm; Tolerance: 10%; Package Reference: 1206; Case Height: 1.6mm; Case Code - in: 1206; Maximum Operating Temperature: +125C; Voltage Rating: 25V
TP1-TP3 = CMP-1672-00008-1: Test Point, 1 Position SMD, RoHS, Tape and Reel; ComponentLink1Description: Manufacturer URL; Package Quantity: 1000; DatasheetVersion: 03/2014; Packaging: Tape and Reel; ComponentLink2URL: http://www.keyelco.com/product-pdf.cfm?p=1357; ComponentLink1URL: http://www.keyelco.com/; Mount: Surface Mount; Contact Plating: Silver; PackageDescription: 1-Pin Surface Mount Device, Body 3.81 x 2.03 mm; Pins: 1; RoHSCompliant: True; Mounting Technology: Surface Mount; ComponentLink2Description: Datasheet; PackageReference: 5019
U4 = CMP-0395-00503-2: Single Output LDO, 1 A, Fixed 3.3 V Output, 2 to 5.5 V Input, 4-pin SOT-223 (DCY), -40 to 125 degC, Green (RoHS & no Sb/Br); Manufacturer: Texas Instruments; Vout Adj(Min)(V): 3.3; Vdo(Typ)(mV): 1200; Iq(Typ)(mA): 0.05; Accuracy(%): 2; Iout(Max)(A): 1; SubFamily: Single Channel LDO; Vin(Max)(V): 5.5; PackageReference: DCY0004A; PackageDescription: 4-Pin Plastic Small Outline, Body 3.5 x 6.5 mm, Pitch 2.3 mm; Vout Adj(Max)(V): 3.3; Mounting Technology: Surface Mount; ComponentLink2Description: Datasheet; ComponentLink1Description: Manufacturer URL; PartNumber: TLV1117LV33DCYR; ComponentLink3Description: Package Specification; ComponentLink1URL: http://www.ti.com/; ComponentLink2URL: http://www.ti.com/general/docs/lit/getliterature.tsp?genericPartNumber=TLV1117LV33&fileType=pdf; Fixed Output Options(V): 3.3; PackageVersion: 4202506/B; Vin(Min)(V): 2; DatasheetVersion: SBVS160A; Eco-Plan: Green (RoHS & no Sb/Br); ComponentLink3URL: http://www.ti.com/litv/pdf/mpds094a; Code_JEDEC: TO-261

## Sheet 09_Buzzer.SchDoc: Buzzer
size A; Revision: A; SheetNumber: 9; SheetTotal: 10; ECE315_Project_Name: ECE315 F23 Wack-A-Mole
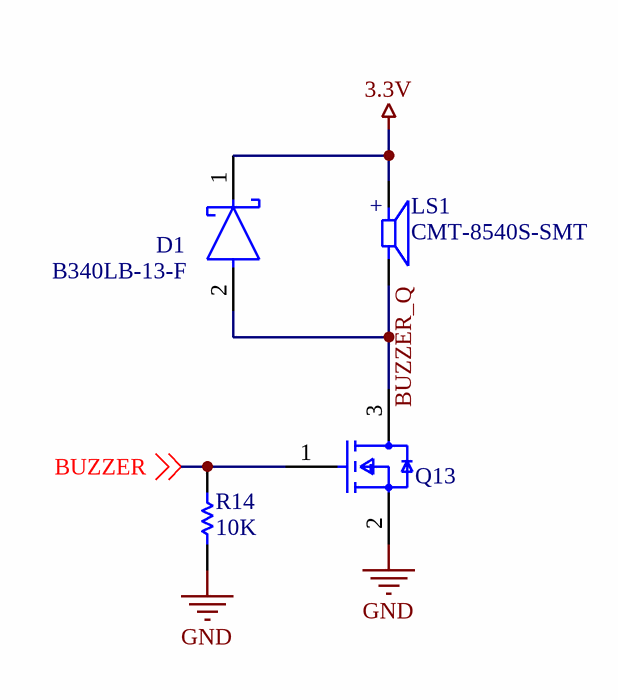
[diagram p6: 09_Buzzer.SchDoc]

### Parts
D1  B340LB-13-F  [FP-SMB-MFG]
LS1  CMT-8540S-SMT  [CUI_CMT-8540S-SMT]
Q13  2N7002-7-F  [FP-SOT23-MFG]  (value not drawn)
R14  Resistance: 10K  [RESC3116X65X40ML10T20]  (hidden comment: RC1206FR-0710KL)

### Nets
3.3V: D1.1(C) LS1.P
GND: Q13.2(S) R14.1
BUZZER: Q13.1(G) R14.2 ; off-sheet BUZZER
BUZZER_Q: D1.2(A) LS1.N Q13.3(D)

### Notes on the sheet
- Title:
- Size:
- A
- Project
- Rev:
- Sheet:
- of
- College of Engineering
- 1415 Engineering Drive
- Madison, WI 53706
- (in symbol CMT-8540S-SMT) +

### Library data of the parts
D1 = CMP-12790-000022-1: DIODE SCHOTTKY 40V 3A SMB; Manufacturer: Diodes Inc.; Max Surge Forward Current: 70A; Value: 180pF; Peak Reverse Current: 2mA; Standoff Height: 0.05mm; Max Junction Temp: +150°C; Forward Voltage: 450mV; Element Configuration: Single; Polarity: Standard; Device Class L2: Diodes; Octopart: https://octopart.com/b340lb-13-f-diodes+inc.-325823; Device Class L1: Discrete Semiconductors; Forward Current: 3A; Automotive: No; Manufacturer Part Number: B340LB-13-F; Temperature: -55°C to +150°C; Temperature Range Low: -55°C; Max Repetitive Reverse Voltage: 40V; Device Class L3: Schottky Diodes; RoHS: TRUE; Height: 2.5mm; ComponentLink2URL: https://www.diodes.com/assets/Datasheets/ds30240.pdf; Package: SMB; Digikey Description: DIODE SCHOTTKY 40V 3A SMB; Lead Free: Yes; Category: Diode; Reverse Voltage: 40V; Mouser Description: Schottky Diodes & Rectifiers 40V 3A; ComponentLink2Description: Datasheet; Footprint Url: https://www.diodes.com/assets/Package-Files/SMB.pdf; Temperature Range High: +150°C; Capacitance: 180pF; Supplier 1: Digi-Key; Supplier Part Number 1: B340LB-FDICT-ND; Stock 1: 168517; Pricing 1: 1=0.43000, 10=0.36500, 100=0.27250, 500=0.21414, 1000=0.16547 (USD); Mount: Surface Mount; Case/Package: SMB; Number of Pins: 2; Weight: 0.00328oz; Min Operating Temperature: -55°C; Max Operating Temperature: 125°C; Max Reverse Current: 2mA; Package Quantity: 3000; Packaging: Tape and Reel; Average Rectified Current: 3A; Max Repetitive Reverse Voltage (Vrrm): 40V; Peak Non-Repetitive Surge Current: 70A; Max Forward Surge Current (Ifsm): 70A; Max Reverse Voltage (DC): 40V; Series: -; Voltage Rating (DC): 40V; Current Rating: 3A; Output Current: 3A; Termination: SMD/SMT; Current: 3A; Voltage: 40V; Length: 4.57mm; Width: 3.94mm; Radiation Hardening: No; Reach SVHC Compliant: Yes; RoHS Compliant: Yes; ComponentLink1URL: https://datasheet.ciiva.com/4715/ds30240-71143-4715794.pdf?src-supplier=Mouser; ComponentLink1Description: https://datasheet.ciiva.com/4715/ds30240-71143-4715794.pdf?src-supplier=Mouser; ComponentLink3URL: https://datasheet.ciiva.com/26949/getdatasheetpartid-146318-26949355.pdf?src-supplier=Verical; ComponentLink3Description: https://datasheet.ciiva.com/26949/getdatasheetpartid-146318-26949355.pdf?src-supplier=Verical; ComponentLink4URL: https://datasheet.ciiva.com/1177/ds30240-1177479.pdf?src-supplier=Element14; ComponentLink4Description: https://datasheet.ciiva.com/1177/ds30240-1177479.pdf?src-supplier=Element14; ComponentLink5URL: https://datasheet.ciiva.com/16380/ds30240-16380877.pdf?src-supplier=Future+Electronics; ComponentLink5Description: https://datasheet.ciiva.com/16380/ds30240-16380877.pdf?src-supplier=Future+Electronics; ComponentLink6URL: https://datasheet.ciiva.com/8303/ds30240-8303077.pdf?src-supplier=Avnet; ComponentLink6Description: https://datasheet.ciiva.com/8303/ds30240-8303077.pdf?src-supplier=Avnet; ComponentLink7URL: https://datasheet.ciiva.com/914/ds30240-914107.pdf?src-supplier=Digi-Key; ComponentLink7Description: https://datasheet.ciiva.com/914/ds30240-914107.pdf?src-supplier=Digi-Key; ComponentLink8URL: https://datasheet.ciiva.com/914/ds30240-914108.pdf?src-supplier=Digi-Key; ComponentLink8Description: https://datasheet.ciiva.com/914/ds30240-914108.pdf?src-supplier=Digi-Key; ComponentLink9URL: https://datasheet.ciiva.com/914/ds30240-914106.pdf?src-supplier=Digi-Key; ComponentLink9Description: https://datasheet.ciiva.com/914/ds30240-914106.pdf?src-supplier=Digi-Key; Supplier 2: Newark; Supplier Part Number 2: 12T1468
LS1 = CMT-8540S-SMT: AUDIO MAGNETIC XDCR 1-6V SMD; Manufacturer 1: CUI; MF: CUI Devices; MP: CMT-8540S-SMT-TR; Voltage Rating: 5V; Frequency: 4kHz; Operating Supply Current: 150mA; CUI_purchase_URL: https://www.cuidevices.com/product/audio/buzzers/audio-transducers/cmt-8540s-smt-tr?utm_source=snapeda.com&utm_medium=referral&utm_campaign=snapedaBOM; SnapEDA_Link: https://www.snapeda.com/parts/CMT-8540S-SMT-TR/CUI%20Devices/view-part/587791/?ref=snap; Availability: Unavailable; Package: CUI Inc.; Value: *; Price: None; Supplier 1: Digi-Key; Supplier Part Number 1: 102-3746-1-ND; Manufacturer Part Number 1: CMT-8540S-SMT-TR; RoHS: Yes; Category: Audio Products; Stock 1: 66147; Pricing 1: 1=3.23000, 10=2.67000, 25=2.46400, 50=2.31400, 100=2.16990, 500=1.91520 (USD); Min Operating Temperature: -20°C; Max Operating Temperature: 70°C; Sensing Method: Magnetic; Lead Free: Lead Free; ComponentLink1URL: https://www.cui.com/product/resource/digikeypdf/cmt-8540s-smt.pdf?src-supplier=Digi-Key; ComponentLink1Description: https://www.cui.com/product/resource/digikeypdf/cmt-8540s-smt.pdf?src-supplier=Digi-Key
Q13 = CMP-2000-04929-2: MOSFET N-CH 60V 115MA SOT23-3; Manufacturer 1: Diodes; Turn-On Delay Time: 7ns; Turn-Off Delay Time: 11ns; Drain to Source Resistance: 7.5R; Rise Time: 3ns; Drain to Source Breakdown Voltage: 70V; Input Capacitance: 50pF; Number of Elements: 1; Power Dissipation: 540mW; Max Power Dissipation: 300mW; Fall Time: 5.6ns; Gate to Source Voltage (Vgs): 20V; Threshold Voltage: 2.5V; Element Configuration: Single; Polarity: N-CHANNEL; Termination: SMD/SMT; Weight: 0.000282oz; Radiation Hardening: No; Max Operating Temperature: 150°C; On-State Resistance: 7.5R; Mount: Surface Mount; Current Rating: 115mA; Contact Plating: Tin; Lead Free: Lead Free; Min Operating Temperature: -55°C; Number of Pins: 3; REACH SVHC: No SVHC; Drain to Source Voltage (Vdss): 60V; Width: 1.3mm; Package Quantity: 3000; Length: 2.9mm; Case/Package: SOT-23; Number of Channels: 1; Dual Supply Voltage: 60V; Packaging: Tape and Reel; Height: 1mm; Voltage Rating (DC): 60V; Nominal Vgs: 2.5V; Continuous Drain Current (ID): 115mA; Voltage: 60V; Rds On Max: 7.5R; Supplier 1: Digi-Key; Supplier Part Number 1: 2N7002-FDICT-ND; Manufacturer Part Number 1: 2N7002-7-F; RoHS: Yes; Category: MOSFETs; Stock 1: 1441532; Pricing 1: 1=0.20000, 10=0.18600, 100=0.10140, 500=0.06236, 1000=0.04252 (USD); Series: -; Drain-source On Resistance-Max: 7.5R; Reach SVHC Compliant: Yes; RoHS Compliant: Yes; ComponentLink1URL: https://datasheet.ciiva.com/15219/getdatasheetpartid-110059-15219667.pdf?src-supplier=Verical; ComponentLink1Description: https://datasheet.ciiva.com/15219/getdatasheetpartid-110059-15219667.pdf?src-supplier=Verical; ComponentLink2URL: https://datasheet.ciiva.com/3304/ds11303-3304385.pdf?src-supplier=Avnet; ComponentLink2Description: https://datasheet.ciiva.com/3304/ds11303-3304385.pdf?src-supplier=Avnet; ComponentLink3URL: https://datasheet.ciiva.com/1188/ds11303-1188363.pdf?src-supplier=Element14; ComponentLink3Description: https://datasheet.ciiva.com/1188/ds11303-1188363.pdf?src-supplier=Element14; ComponentLink4URL: https://datasheet.ciiva.com/22712/1915452-22712375.pdf?src-supplier=Element14; ComponentLink4Description: https://datasheet.ciiva.com/22712/1915452-22712375.pdf?src-supplier=Element14; ComponentLink5URL: https://datasheet.ciiva.com/49020/70437206-49020102.pdf?src-supplier=Allied+Electronics; ComponentLink5Description: https://datasheet.ciiva.com/49020/70437206-49020102.pdf?src-supplier=Allied+Electronics
R14 = CMP-1014-00623-2: as R5 on sheet 06_MCU; Packaging: TapeandReel; Termination: SMD/SMT; REACH SVHC: Unknown; Tolerance: 1%; Height: 0.55mm; Composition: ThickFilm; Max Operating Temperature: 155degC; Datasheet Version: Rev. 5, 10/2016; Lead Free: LeadFree; Case Code (Metric): 3216; Depth: 1.6mm; Package Quantity: 5000; RoHSCompliant: true; Military Standard: Not; Case/Package: 1206; Case Code (Imperial): 1206; Min Operating Temperature: -55degC; Datasheet URL: http://www.yageo.com/NewPortal/yageodocoutput?fileName=/pdf/R-Chip/PYu-RC_Group_51_RoHS_L_5.pdf; Length: 3.1mm; Manufacturer URL: http://www.yageo.com/; Package Reference: 1206.0; Width: 1.6mm; Package Description: 2-Pin Surface Mount Device, Body 3.1 x 1.6 mm; Supplier 1: Digi-Key; Supplier Part Number 1: 311-10.0KFRCT-ND; Manufacturer Part Number: RC1206FR-0710KL; RoHS: Yes; Category: Chip SMD Resistors; Stock 1: 3827063; Pricing 1: 1=0.10000, 10=0.03700, 100=0.02040, 1000=0.01236, 2500=0.01036 (USD); Size Code: 1206; Series: RC; Resistance Tolerance: 1%; Resistor Type: Thick Film; Max Power Dissipation: 250mW; Number of Terminations: 2; Construction: Rectangular; Features: Moisture Resistant; RoHS Compliant: Yes; ComponentLink1URL: https://datasheet.ciiva.com/46445/444357-46445703.pdf?src-supplier=Element14; ComponentLink1Description: https://datasheet.ciiva.com/46445/444357-46445703.pdf?src-supplier=Element14; ComponentLink2URL: https://datasheet.ciiva.com/7857/1692832-7857244.pdf?src-supplier=Element14; ComponentLink2Description: https://datasheet.ciiva.com/7857/1692832-7857244.pdf?src-supplier=Element14; ComponentLink3URL: https://datasheet.ciiva.com/7857/1692832-7857245.pdf?src-supplier=Element14; ComponentLink3Description: https://datasheet.ciiva.com/7857/1692832-7857245.pdf?src-supplier=Element14; Supplier 2: Newark; Supplier Part Number 2: 98K7621

## Sheet 10-Programmer.SchDoc: ECE315 Analog
size A; Date: 4/25/2017; ApprovedBy: JSK; CheckedBy: JSK; Author: JSK; CompanyName: University of Wisconsin; DrawnBy: JSK; Engineer: JSK; Organization: ECE 315; Address1: College of Engineering; Address2: 1415 Engineering Drive; Address3: Madison, WI 53706; Address4: ECE 315 Fall 2017; Revision: A; SheetNumber: 10; SheetTotal: 10; AssemblyNumber: ECE315-F19; ApprovedDate: 04/02/2019; ECE315_Project_Name: ECE353 F23 Wack-A-Mole
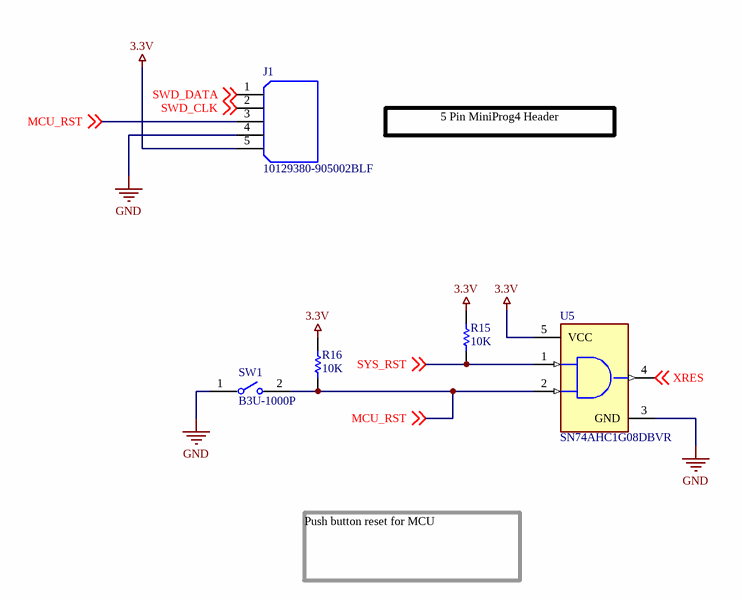
[diagram p7: 10-Programmer.SchDoc]

### Parts
J1  10129380-905002BLF  [AMPHENOL_10129380-905002BLF]
R15  Resistance: 10K  [RESC3116X65X40ML10T20]  (hidden comment: RC1206FR-0710KL)
R16  Resistance: 10K  [RESC3116X65X40ML10T20]  (hidden comment: RC1206FR-0710KL)
SW1  B3U-1000P  [FP-B3U-1000P-MFG]
U5  SN74AHC1G08DBVR  [FP-DBV0005A-MFG]

### Nets
3.3V: J1.5 R15.2 R16.2 U5.5(VCC)
GND: J1.4 SW1.1 U5.3(GND)
MCU_RST: J1.3 R16.1 SW1.2 U5.2(B) ; off-sheet MCU_RST
SWD_CLK: J1.2 ; off-sheet SWD_CLK
SWD_DATA: J1.1 ; off-sheet SWD_DATA
SYS_RST: R15.1 U5.1(A) ; off-sheet SYS_RST
XRES: U5.4(Y) ; off-sheet XRES

### Notes on the sheet
- 5 Pin MiniProg4 Header
- Push button reset for MCU
- Title:
- Size:
- A
- Project
- Rev:
- Sheet:
- of
- College of Engineering
- 1415 Engineering Drive
- Madison, WI 53706

### Library data of the parts
J1 = 10129380-905002BLF: Conn Unshrouded Header HDR 5 POS 2.54mm Solder ST SMD Poly Bag; Manufacturer 1: ICC; MF: AMPHENOL ICC / FCI; Package: None; Price: None; Check_prices: https://www.snapeda.com/parts/10129380-905002BLF/Amphenol/view-part/?ref=eda; Value: *; SnapEDA_Link: https://www.snapeda.com/parts/10129380-905002BLF/Amphenol/view-part/?ref=snap; MP: 10129380-905002BLF; Availability: In Stock; Purchase-URL: https://pricing.snapeda.com/search/part/10129380-905002BLF/?ref=eda; Supplier 1: Digi-Key; Supplier Part Number 1: 10129380-905002BLF-ND; Manufacturer Part Number 1: 10129380-905002BLF; RoHS: No
R15 R16 = CMP-1014-00623-2: as R5 on sheet 06_MCU; Packaging: TapeandReel; Termination: SMD/SMT; REACH SVHC: Unknown; Tolerance: 1%; Height: 0.55mm; Composition: ThickFilm; Max Operating Temperature: 155degC; Datasheet Version: Rev. 5, 10/2016; Lead Free: LeadFree; Case Code (Metric): 3216; Depth: 1.6mm; Package Quantity: 5000; RoHSCompliant: true; Military Standard: Not; Case/Package: 1206; Case Code (Imperial): 1206; Min Operating Temperature: -55degC; Datasheet URL: http://www.yageo.com/NewPortal/yageodocoutput?fileName=/pdf/R-Chip/PYu-RC_Group_51_RoHS_L_5.pdf; Length: 3.1mm; Manufacturer URL: http://www.yageo.com/; Package Reference: 1206.0; Width: 1.6mm; Package Description: 2-Pin Surface Mount Device, Body 3.1 x 1.6 mm; Supplier 1: Digi-Key; Supplier Part Number 1: 311-10.0KFRCT-ND; Manufacturer Part Number: RC1206FR-0710KL; RoHS: Yes; Category: Chip SMD Resistors; Stock 1: 3827063; Pricing 1: 1=0.10000, 10=0.03700, 100=0.02040, 1000=0.01236, 2500=0.01036 (USD); Size Code: 1206; Series: RC; Resistance Tolerance: 1%; Resistor Type: Thick Film; Max Power Dissipation: 250mW; Number of Terminations: 2; Construction: Rectangular; Features: Moisture Resistant; RoHS Compliant: Yes; ComponentLink1URL: https://datasheet.ciiva.com/46445/444357-46445703.pdf?src-supplier=Element14; ComponentLink1Description: https://datasheet.ciiva.com/46445/444357-46445703.pdf?src-supplier=Element14; ComponentLink2URL: https://datasheet.ciiva.com/7857/1692832-7857244.pdf?src-supplier=Element14; ComponentLink2Description: https://datasheet.ciiva.com/7857/1692832-7857244.pdf?src-supplier=Element14; ComponentLink3URL: https://datasheet.ciiva.com/7857/1692832-7857245.pdf?src-supplier=Element14; ComponentLink3Description: https://datasheet.ciiva.com/7857/1692832-7857245.pdf?src-supplier=Element14; Supplier 2: Newark; Supplier Part Number 2: 98K7621
SW1 = CMP-2100-03586-2: SWITCH TACTILE SPST-NO 0.05A 12V; Manufacturer: Omron; Contact Resistance: 100mR; Operating Force: 1.5N; Max Current Rating: 50mA; Switch Travel: 0.15mm; Actuator Type: Standard; Mechanical Life: 200000Cycles; Ratings: Dust Proof; Illumination Type: Non-Illuminated; Throw Configuration: SPST; Actuator Length: 0.4mm; Switch Function: Off-Mom; Height: 1.2mm; Width: 3mm; Weight: 0.000776oz; Contact Material: Silver; Max Voltage Rating (DC): 12V; Insulation Resistance: 100MR; Lead Free: Lead Free; Current Rating: 50mA; Termination: SMD/SMT; Length: 4mm; Voltage Rating (DC): 12V; Contact Current Rating: 50mA; Orientation: Straight; Depth: 2.5mm; Max Operating Temperature: 70°C; Packaging: Tape and Reel; Min Operating Temperature: -25°C; Package Quantity: 1; Mount: Surface Mount; Electrical Life: 200000Cycles; Supplier: Digi-Key; Supplier Part Number: SW1020CT-ND; Manufacturer Part Number: B3U-1000P; RoHS: Yes; Category: Tactile Switches; Stock: 65266; Pricing: 1=1.02, 10=0.983, 25=0.9188, 100=0.7977, 250=0.72584, 500=0.67292, 1000=0.62377 (USD); Mounting Technology: Surface Mount; Series: B3U; RoHS Compliant: Yes; Reach SVHC Compliant: Unknown
U5 = CMP-0859-00043-4: IC GATE AND 1CH 2-INP SOT23-5; Manufacturer: Texas Instruments; Number Of Outputs: 1; Nominal Supply Current: 1uA; Standoff Height: 0mm; Max Supply Voltage: 5.5V; Min Supply Voltage: 2V; Max Junction Temp: +150°C; Propagation Delay: 5.8ns; Number Of Inputs: 2; Logic Function Desc: Non-Inverting; Output Current: 8mA; Logic Function: AND GATE; High Level Output Current: -8mA; Turn-On Delay Time: 12.3ns; Device Class L3: Logic Gates; Category: IC; ComponentLink2Description: Datasheet; Device Class L2: Logic ICs; RoHS: TRUE; Device Class L1: Integrated Circuits (ICs); Manufacturer Part Number: SN74AHC1G08DBVR; Temperature Range Low: -55°C; Number Of Circuits: 1; Automotive: No; Lead Free: Yes; Temperature Range High: +125°C; Digikey Description: IC GATE AND 1CH 2-INP SOT23-5; Ambient Temperature Range High: +125°C; Ambient Temperature Range Low: -55°C; Package: DBV0005A; Mouser Description: AND Gate 1-Element 2-IN CMOS 5-Pin SOT-23 AND Gate 1-Element 2-IN CMOS 5-Pin SOT-23 AND Gate 1-Element 2-IN CMOS 5-Pi...; ComponentLink2URL: http://www.ti.com/lit/ds/symlink/sn74ahc1g08.pdf; Height: 1.45mm; Temperature: -55°C to +125°C; Octopart: https://octopart.com/sn74ahc1g08dbvr-texas+instruments-464404; Supplier: Digi-Key; Supplier Part Number: 296-1091-1-ND; Stock: 156425; Pricing: 1=0.34, 10=0.25, 25=0.2184, 100=0.1413, 250=0.117, 500=0.0936, 1000=0.07176 (USD); Mounting Technology: Surface Mount; Case/Package: SOT-23; Pins: 5; Weight: 0.000557oz; Min Operating Temperature: -55°C; Max Operating Temperature: 125°C; Number of Gates: 1; Packaging: Tape and Reel; Number of Elements: 1; Low Level Output Current: 8mA; Quiescent Current: 1uA; Series: 74AHC; Technology: CMOS; Package Quantity: 3000; Number of Bits: 1; Number of Input Lines: 2; Number of Output Lines: 1; Max Output current: 8mA; Termination: SMD/SMT; Length: 2.9mm; Width: 1.6mm; Radiation Hardening: No; Reach SVHC Compliant: No; RoHS Compliant: Yes

## Nets that join several sheets
3.3V: 06_MCU (7 pins), 08-Power (C6.2 TP2.1 U4.2 U4.4), 09_Buzzer (D1.1 LS1.P), 10-Programmer (J1.5 R15.2 R16.2 U5.5)
5.0V: 02-UART (8 pins), 03-LED-GREEN (R1.1 R2.1 R3.1 R4.1), 04-LED-YELLOW (R6.1 R7.1 R8.1 R9.1), 05-LED-RED (R10.1 R11.1 R12.1 R13.1), 08-Power (C5.2 TP1.1 U4.3)
GND: 02-UART (10 pins), 03-LED-GREEN (Q1.2 Q2.2 Q3.2 Q4.2), 04-LED-YELLOW (Q5.2 Q6.2 Q7.2 Q8.2), 05-LED-RED (Q9.2 Q10.2 Q11.2 Q12.2), 06_MCU (9 pins), 08-Power (C5.1 C6.1 TP3.1 U4.1), 09_Buzzer (Q13.2 R14.1), 10-Programmer (J1.4 SW1.1 U5.3)
BUZZER: 06_MCU (U2.17), 09_Buzzer (Q13.1 R14.2)
EN_G1: 03-LED-GREEN (Q1.1), 06_MCU (U2.43)
EN_G2: 03-LED-GREEN (Q2.1), 06_MCU (U2.44)
EN_G3: 03-LED-GREEN (Q3.1), 06_MCU (U2.45)
EN_G4: 03-LED-GREEN (Q4.1), 06_MCU (U2.46)
EN_R1: 05-LED-RED (Q9.1), 06_MCU (U2.28)
EN_R2: 05-LED-RED (Q10.1), 06_MCU (U2.29)
EN_R3: 05-LED-RED (Q11.1), 06_MCU (U2.30)
EN_R4: 05-LED-RED (Q12.1), 06_MCU (U2.31)
EN_Y1: 04-LED-YELLOW (Q5.1), 06_MCU (U2.33)
EN_Y2: 04-LED-YELLOW (Q6.1), 06_MCU (U2.34)
EN_Y3: 04-LED-YELLOW (Q7.1), 06_MCU (U2.35)
EN_Y4: 04-LED-YELLOW (Q8.1), 06_MCU (U2.42)
SWD_CLK: 06_MCU (U2.16), 10-Programmer (J1.2)
SWD_DATA: 06_MCU (U2.14), 10-Programmer (J1.1)
SYS_RST: 02-UART (J4.6 J5.6), 10-Programmer (R15.1 U5.1)
UART0_RX: 02-UART (J2.4 J4.4), 06_MCU (U2.22)
UART0_TX: 02-UART (J2.5 J4.5), 06_MCU (U2.23)
UART1_RX: 02-UART (J3.4 J5.5), 06_MCU (U2.12)
UART1_TX: 02-UART (J3.5 J5.4), 06_MCU (U2.13)
XRES: 06_MCU (U2.36), 10-Programmer (U5.4)